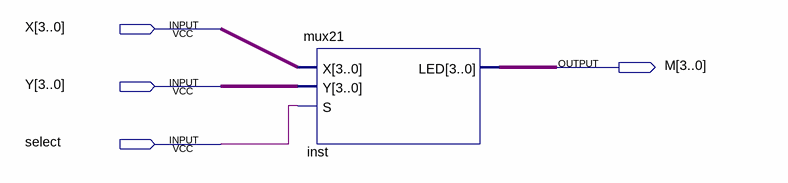
[diagram p0: schematic sheet]
// Quartus schematic mux21_SCHEME.bdf as structural Verilog: 1 symbols, 4 pins
module mux21_SCHEME (
  input  [3:0] X,
  input  [3:0] Y,
  input  select,
  output [3:0] M
);

  mux21 inst (.X(X), .Y(Y), .S(select), .LED(M));
endmodule
